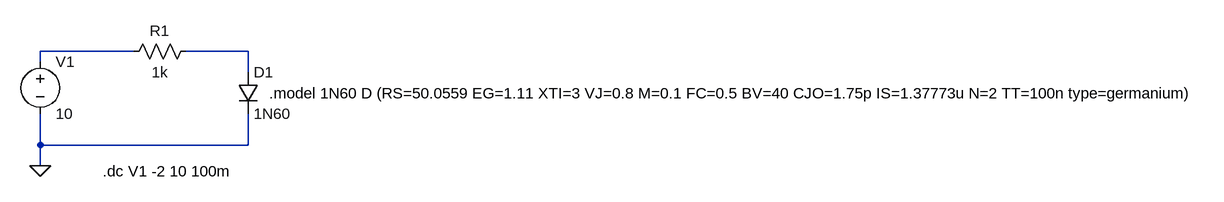
[diagram p0: schematic TP2DEge.asc]
TP2DEge.asc, the LTspice schematic file:
Version 4.1
SHEET 1 1884 680
WIRE 112 96 -32 96
WIRE 288 96 192 96
WIRE -32 112 -32 96
WIRE 288 128 288 96
WIRE -32 240 -32 192
WIRE 288 240 288 192
WIRE 288 240 -32 240
WIRE -32 272 -32 240
FLAG -32 272 0
SYMBOL res 208 80 R90
WINDOW 0 0 56 VBottom 2
WINDOW 3 32 56 VTop 2
SYMATTR InstName R1
SYMATTR Value 1k
SYMBOL voltage -32 96 R0
WINDOW 123 0 0 Left 0
WINDOW 39 0 0 Left 0
SYMATTR InstName V1
SYMATTR Value 10
SYMBOL diode 272 128 R0
SYMATTR InstName D1
SYMATTR Value 1N60
TEXT 64 280 Left 2 !.dc V1 -2 10 100m
TEXT 320 160 Left 2 !.model 1N60 D (RS=50.0559 EG=1.11 XTI=3 VJ=0.8 M=0.1 FC=0.5 BV=40 CJO=1.75p IS=1.37773u N=2 TT=100n type=germanium)

The netlist it stands for:
* TP2DEge.asc
R1 N002 N001 1k
V1 N001 0 10
D1 N002 0 1N60
.model D D
.lib standard.dio
.dc V1 -2 10 100m
.model 1N60 D (RS=50.0559 EG=1.11 XTI=3 VJ=0.8 M=0.1 FC=0.5 BV=40 CJO=1.75p IS=1.37773u N=2 TT=100n type=germanium)
.backanno
.end